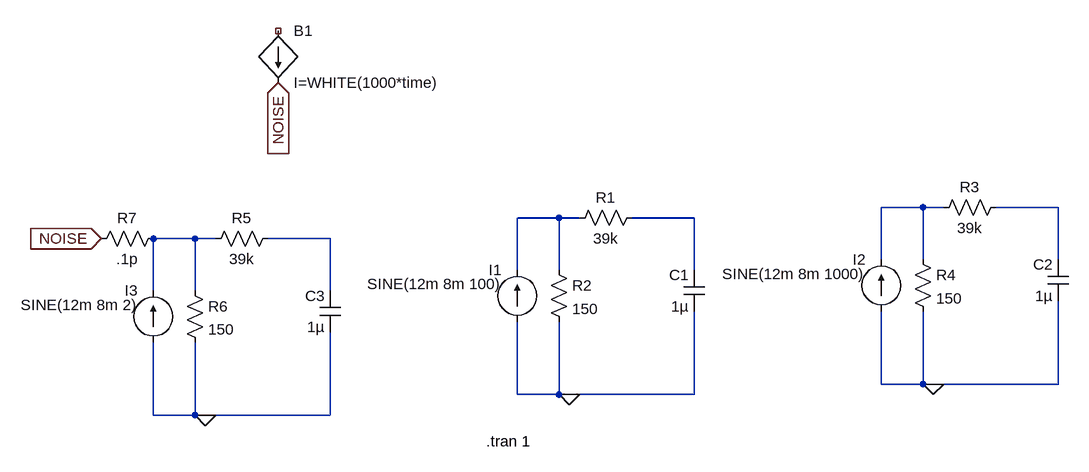
[diagram p0: schematic Draft1.asc]
Draft1.asc, the LTspice schematic file:
Version 4
SHEET 1 964 680
WIRE 736 128 672 128
WIRE 768 128 736 128
WIRE 944 128 848 128
WIRE 176 144 112 144
WIRE 208 144 176 144
WIRE 384 144 288 144
WIRE -384 176 -448 176
WIRE -352 176 -384 176
WIRE -176 176 -272 176
WIRE 672 208 672 128
WIRE 736 208 736 128
WIRE 944 208 944 128
WIRE 112 224 112 144
WIRE 176 224 176 144
WIRE 384 224 384 144
WIRE -448 256 -448 176
WIRE -384 256 -384 176
WIRE -176 256 -176 176
WIRE 672 400 672 288
WIRE 736 400 736 288
WIRE 736 400 672 400
WIRE 752 400 736 400
WIRE 944 400 944 272
WIRE 944 400 752 400
WIRE 112 416 112 304
WIRE 176 416 176 304
WIRE 176 416 112 416
WIRE 192 416 176 416
WIRE 384 416 384 288
WIRE 384 416 192 416
WIRE -448 448 -448 336
WIRE -384 448 -384 336
WIRE -384 448 -448 448
WIRE -368 448 -384 448
WIRE -176 448 -176 320
WIRE -176 448 -368 448
FLAG 192 416 0
FLAG 752 400 0
FLAG -368 448 0
FLAG -256 -64 NOISE
IOPIN -256 -64 In
FLAG -528 176 NOISE
IOPIN -528 176 In
SYMBOL Res 304 128 R90
WINDOW 0 0 56 VBottom 2
WINDOW 3 32 56 VTop 2
SYMATTR InstName R1
SYMATTR Value 39k
SYMBOL Cap 400 288 R180
WINDOW 0 24 56 Left 2
WINDOW 3 24 8 Left 2
SYMATTR InstName C1
SYMATTR Value 1µ
SYMBOL Res 160 208 R0
SYMATTR InstName R2
SYMATTR Value 150
SYMBOL current 112 304 R180
WINDOW 0 24 80 Left 2
WINDOW 3 24 58 Left 2
SYMATTR InstName I1
SYMATTR Value SINE(12m 8m 100)
SYMATTR Value2 AC 20m
SYMBOL Res 864 112 R90
WINDOW 0 0 56 VBottom 2
WINDOW 3 32 56 VTop 2
SYMATTR InstName R3
SYMATTR Value 39k
SYMBOL Cap 960 272 R180
WINDOW 0 24 56 Left 2
WINDOW 3 24 8 Left 2
SYMATTR InstName C2
SYMATTR Value 1µ
SYMBOL Res 720 192 R0
SYMATTR InstName R4
SYMATTR Value 150
SYMBOL current 672 288 R180
WINDOW 0 24 80 Left 2
WINDOW 3 24 58 Left 2
SYMATTR InstName I2
SYMATTR Value SINE(12m 8m 1000)
SYMATTR Value2 AC 20m
SYMBOL Res -256 160 R90
WINDOW 0 0 56 VBottom 2
WINDOW 3 32 56 VTop 2
SYMATTR InstName R5
SYMATTR Value 39k
SYMBOL Cap -160 320 R180
WINDOW 0 24 56 Left 2
WINDOW 3 24 8 Left 2
SYMATTR InstName C3
SYMATTR Value 1µ
SYMBOL Res -400 240 R0
SYMATTR InstName R6
SYMATTR Value 150
SYMBOL current -448 336 R180
WINDOW 0 24 80 Left 2
WINDOW 3 24 58 Left 2
SYMATTR InstName I3
SYMATTR Value SINE(12m 8m 2)
SYMATTR Value2 AC 20m
SYMBOL bi -256 -144 R0
SYMATTR InstName B1
SYMATTR Value I=WHITE(1000*time)
SYMBOL Res -432 160 R90
WINDOW 0 0 56 VBottom 2
WINDOW 3 32 56 VTop 2
SYMATTR InstName R7
SYMATTR Value .1p
TEXT 64 488 Left 2 !.tran 1

The netlist it stands for:
* Draft1.asc
R1 N004 N003 39k
C1 0 N004 1µ
R2 N003 0 150
I1 0 N003 SINE(12m 8m 100) AC 20m
R3 N002 N001 39k
C2 0 N002 1µ
R4 N001 0 150
I2 0 N001 SINE(12m 8m 1000) AC 20m
R5 N006 N005 39k
C3 0 N006 1µ
R6 N005 0 150
I3 0 N005 SINE(12m 8m 2) AC 20m
B1 NC_01 NOISE I=WHITE(1000*time)
R7 N005 NOISE .1p
.tran 1
.backanno
.end